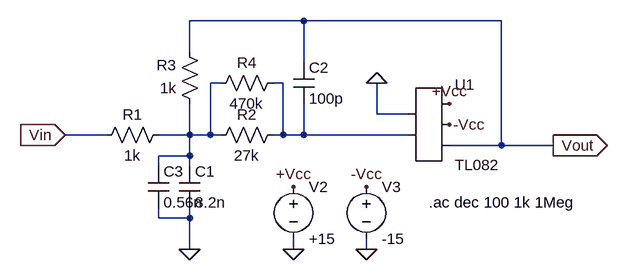
[diagram p0: schematic LPRauch3.asc]
LPRauch3.asc, the LTspice schematic file:
Version 4
SHEET 1 880 680
WIRE -64 -32 -240 -32
WIRE 240 -32 -64 -32
WIRE -240 16 -240 -32
WIRE -64 32 -64 -32
WIRE -192 64 -208 64
WIRE -96 64 -112 64
WIRE 48 112 48 64
WIRE 96 112 48 112
WIRE -368 144 -432 144
WIRE -240 144 -240 96
WIRE -240 144 -288 144
WIRE -208 144 -208 64
WIRE -208 144 -240 144
WIRE -192 144 -208 144
WIRE -96 144 -96 64
WIRE -96 144 -112 144
WIRE -64 144 -64 96
WIRE -64 144 -96 144
WIRE 96 144 -64 144
WIRE 240 160 240 -32
WIRE 240 160 160 160
WIRE 320 160 240 160
WIRE -240 176 -240 144
WIRE -240 176 -288 176
WIRE -288 192 -288 176
WIRE -240 192 -240 176
WIRE -288 272 -288 256
WIRE -240 272 -240 256
WIRE -240 272 -288 272
WIRE -240 320 -240 272
WIRE -80 320 -80 304
WIRE 32 320 32 304
FLAG -80 320 0
FLAG 32 320 0
FLAG 48 64 0
FLAG -240 320 0
FLAG -432 144 Vin
IOPIN -432 144 In
FLAG 320 160 Vout
IOPIN 320 160 Out
FLAG 160 96 +Vcc
FLAG -80 224 +Vcc
FLAG 160 128 -Vcc
FLAG 32 224 -Vcc
SYMBOL AutoGenerated\\TL082 128 128 R0
SYMATTR InstName U1
SYMBOL voltage -80 208 R0
WINDOW 123 0 0 Left 0
WINDOW 39 0 0 Left 0
SYMATTR InstName V2
SYMATTR Value +15
SYMBOL voltage 32 208 R0
WINDOW 123 0 0 Left 0
WINDOW 39 0 0 Left 0
SYMATTR InstName V3
SYMATTR Value -15
SYMBOL res -272 128 R90
WINDOW 0 0 56 VBottom 2
WINDOW 3 32 56 VTop 2
SYMATTR InstName R1
SYMATTR Value 1k
SYMBOL res -96 128 R90
WINDOW 0 0 56 VBottom 2
WINDOW 3 32 56 VTop 2
SYMATTR InstName R2
SYMATTR Value 27k
SYMBOL res -224 112 R180
WINDOW 0 36 76 Left 2
WINDOW 3 36 40 Left 2
SYMATTR InstName R3
SYMATTR Value 1k
SYMBOL cap -256 192 R0
SYMATTR InstName C1
SYMATTR Value 8.2n
SYMBOL cap -80 32 R0
SYMATTR InstName C2
SYMATTR Value 100p
SYMBOL cap -304 192 R0
SYMATTR InstName C3
SYMATTR Value 0.56n
SYMBOL res -96 48 R90
WINDOW 0 0 56 VBottom 2
WINDOW 3 32 56 VTop 2
SYMATTR InstName R4
SYMATTR Value 470k
TEXT 128 248 Left 2 !.ac dec 100 1k 1Meg

The netlist it stands for:
* LPRauch3.asc
* U1: TL082 (symbol AutoGenerated\TL082 not available, pins judged from their places): pin1=0 pin2=N002 pin3=+Vcc pin4=-Vcc pin5=Vout
V2 +Vcc 0 +15
V3 -Vcc 0 -15
R1 N001 Vin 1k
R2 N002 N001 27k
R3 N001 Vout 1k
C1 N001 0 8.2n
C2 Vout N002 100p
C3 N001 0 0.56n
R4 N002 N001 470k
.ac dec 100 1k 1Meg
.backanno
.end